# Altium schematic sheet STM32-PROX_4.SchDoc
size 269 x 204 mm
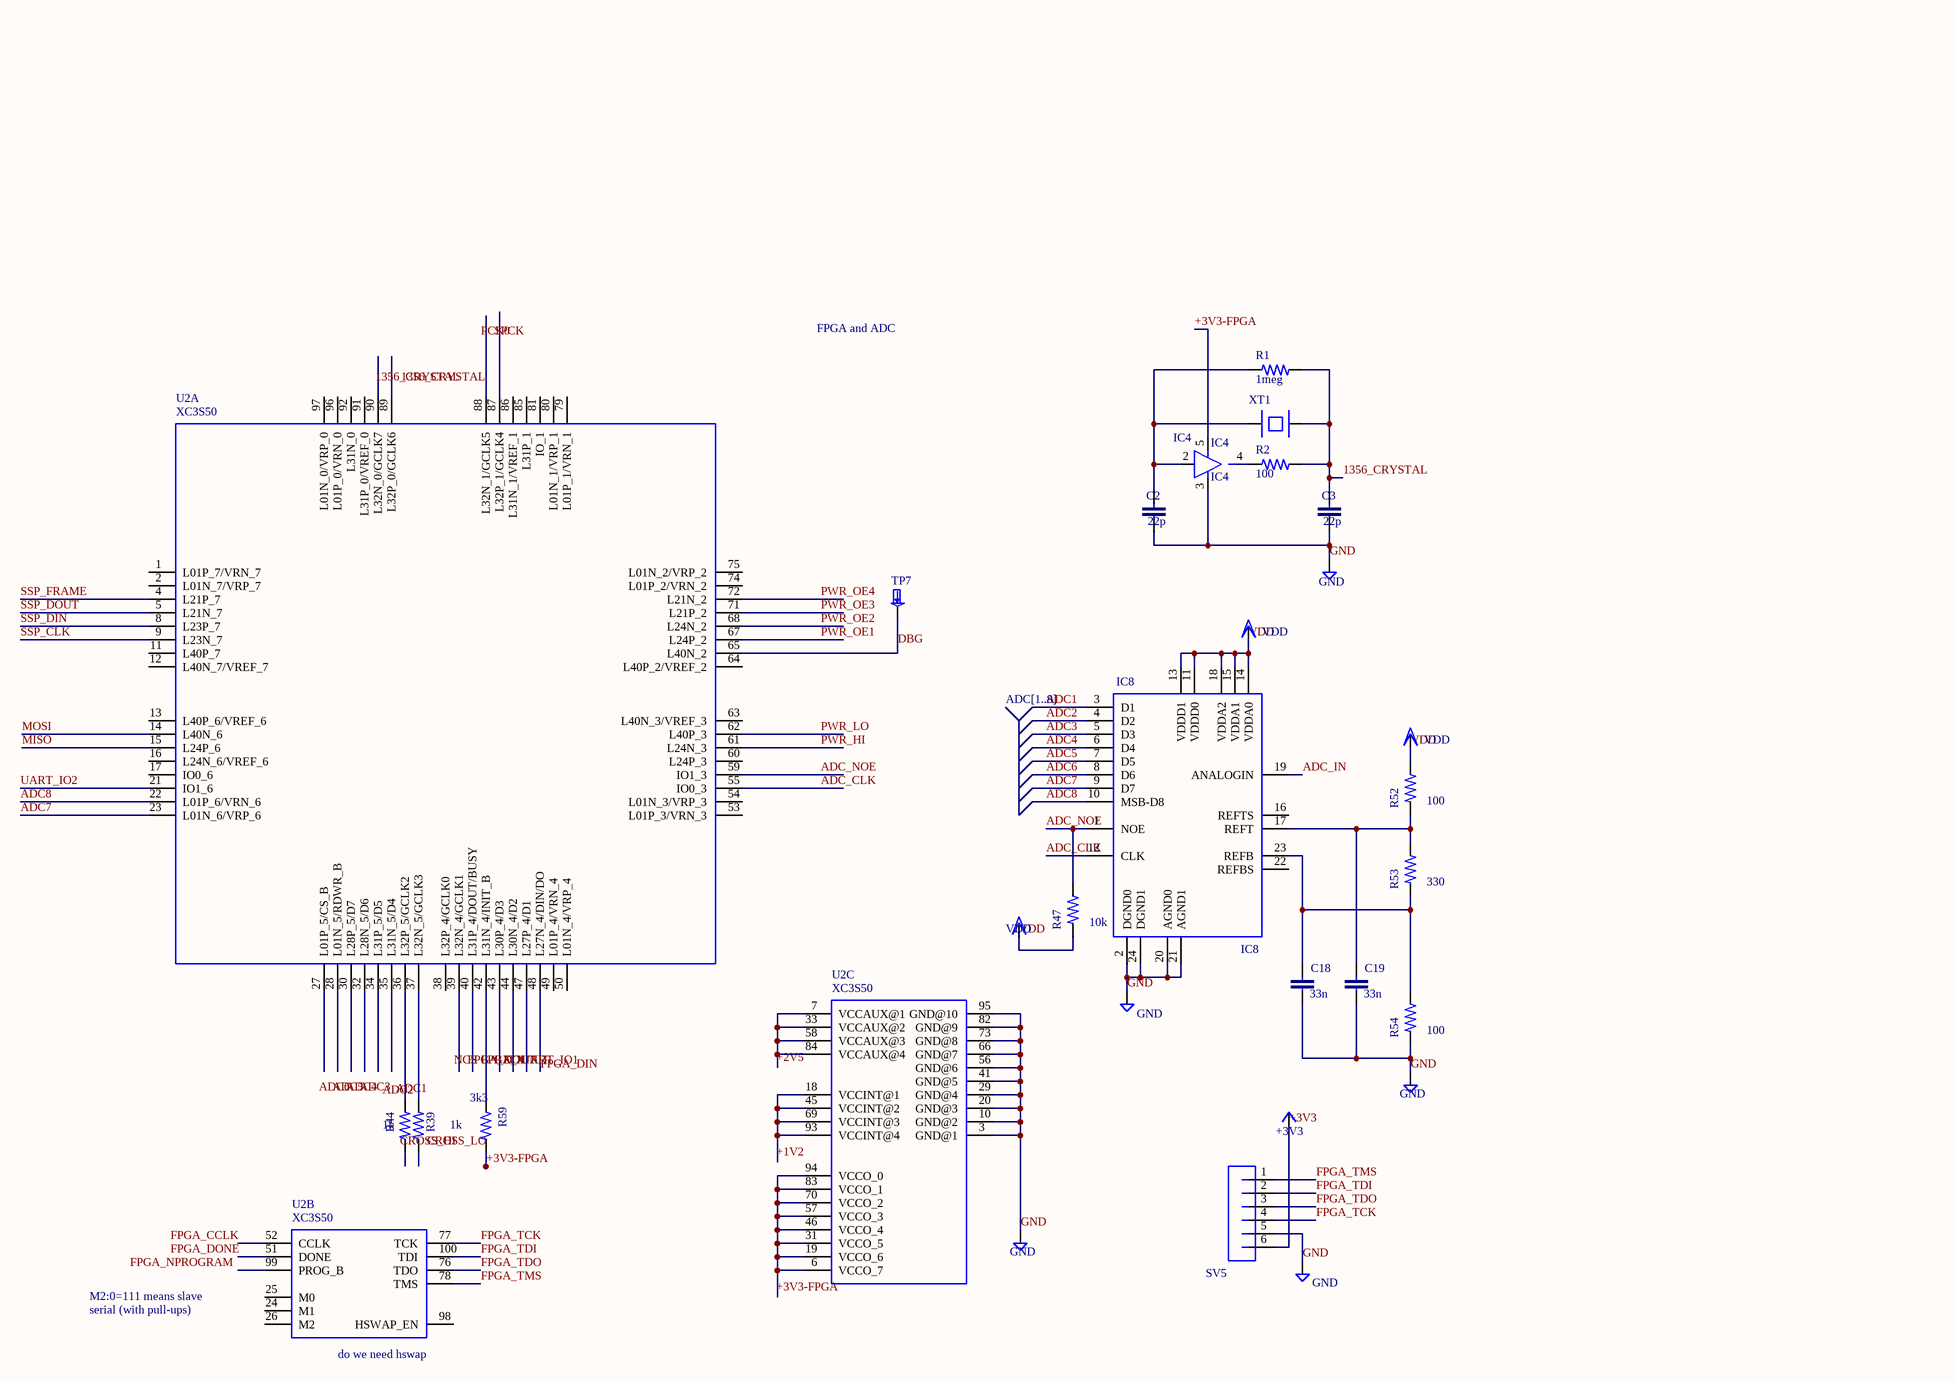
[diagram p0: STM32-PROX_4.SchDoc]

## Parts
C2  22p  [RLC_0603]
C3  22p  [RLC_0603]
C18  33n  [RLC_0603]
C19  33n  [RLC_0603]
IC4  (no value)  [SMV-5]
IC8  (no value)  [TSSOP-24]
R1  1meg  [RLC_0603]
R2  100  [RLC_0603]
R39  1k  [RLC_0603]
R44  1k  [RLC_0603]
R47  10k  [RLC_0603]
R52  100  [RLC_0603]
R53  330  [RLC_0603]
R54  100  [RLC_0603]
R59  3k3  [RLC_0603]
STM32-PROX  GND
SV5  (no value)  [HEADER-MALE-6X1-0.100-UNKEYED]
TP7  (no value)  [KEYSTONE-SMD-TESTPOINT-5015]
U2  XC3S50  [VQ100]  (parts A,B,C of 3)
U$5  +3V3
V7  GND
V24  GND
V28  GND
V55  GND
VDD4  VDD
VDD10  VDD
VDD11  VDD
XT1  (no value)  [XTAL-SMD-CITIZEN-CS10]

## Nets
1356_CRYSTAL: C3.1 R1.2 R2.2 XT1.B
+3V3: SV5.6 U$5.0(+3V3)
+3V3-FPGA: IC4.5(VDD) R59.2
ADC1: IC8.3(D1)
ADC2: IC8.4(D2)
ADC3: IC8.5(D3)
ADC4: IC8.6(D4)
ADC5: IC8.7(D5)
ADC6: IC8.8(D6)
ADC7: IC8.9(D7) U2.23(L01N_6/VRP_6)
ADC8: IC8.10(MSB-D8) U2.22(L01P_6/VRN_6)
ADC_CLK: IC8.12(CLK) U2.55(IO0_3)
ADC_IN: IC8.19(ANALOGIN)
ADC_NOE: IC8.1(NOE) R47.2 U2.59(IO1_3)
DBG: TP7.1(P$1) U2.65(L40N_2)
FPGA_DIN: U2.48(L27N_4/DIN/DO)
FPGA_TCK: SV5.4 U2.77(TCK)
FPGA_TDI: SV5.2 U2.100(TDI)
FPGA_TDO: SV5.3 U2.76(TDO)
FPGA_TMS: SV5.1 U2.78(TMS)
GND: C2.2 C3.2 C18.2 C19.2 IC4.3(VSS) IC8.2(DGND0) IC8.20(AGND0) IC8.21(AGND1) IC8.24(DGND1) R54.1 STM32-PROX.0(GND) SV5.5 U2.3(GND@1) U2.10(GND@2) U2.20(GND@3) U2.29(GND@4) U2.41(GND@5) U2.56(GND@6) U2.66(GND@7) U2.73(GND@8) U2.82(GND@9) U2.95(GND@10) V7.0(GND) V24.0(GND) V28.0(GND) V55.0(GND)
MISO: U2.15(L24P_6)
MOSI: U2.14(L40N_6)
PWR_HI: U2.61(L24N_3)
PWR_LO: U2.62(L40P_3)
PWR_OE1: U2.67(L24P_2)
PWR_OE2: U2.68(L24N_2)
PWR_OE3: U2.71(L21P_2)
PWR_OE4: U2.72(L21N_2)
SSP_CLK: U2.9(L23N_7)
SSP_DIN: U2.8(L23P_7)
SSP_DOUT: U2.5(L21N_7)
SSP_FRAME: U2.4(L21P_7)
UART_IO2: U2.21(IO1_6)
VDD: IC8.11(VDDD0) IC8.13(VDDD1) IC8.14(VDDA0) IC8.15(VDDA1) IC8.18(VDDA2) R47.1 R52.2 VDD4.0(VDD) VDD10.0(VDD) VDD11.0(VDD)
NetC2_1: C2.1 IC4.2(A) R1.1 XT1.A
NetC18_1: C18.1 IC8.23(REFB) R53.1 R54.2
NetC19_1: C19.1 IC8.17(REFT) R52.1 R53.2
NetIC4_4: IC4.4(Y) R2.1
NetR39_2: R39.2 U2.37(L32N_5/GCLK3)
NetR44_2: R44.2 U2.36(L32P_5/GCLK2)
NetR59_1: R59.1 U2.42(L31N_4/INIT_B)
NetU2_6: U2.6(VCCO_7) U2.19(VCCO_6) U2.31(VCCO_5) U2.46(VCCO_4) U2.57(VCCO_3) U2.70(VCCO_2) U2.83(VCCO_1) U2.94(VCCO_0)
NetU2_7: U2.7(VCCAUX@1) U2.33(VCCAUX@2) U2.58(VCCAUX@3) U2.84(VCCAUX@4)
NetU2_18: U2.18(VCCINT@1) U2.45(VCCINT@2) U2.69(VCCINT@3) U2.93(VCCINT@4)

Not connected (* = marked no-connect by the designer): IC8 16(REFTS) 22(REFBS); R39 1; R44 1; U2 1(L01P_7/VRN_7) 2(L01N_7/VRP_7) 11(L40P_7) 12(L40N_7/VREF_7) 13(L40P_6/VREF_6) 16(L24N_6/VREF_6) 17(IO0_6) 24(M1) 25(M0) 26(M2) 27(L01P_5/CS_B) 28(L01N_5/RDWR_B) 30(L28P_5/D7) 32(L28N_5/D6) 34(L31P_5/D5) 35(L31N_5/D4) 38(L32P_4/GCLK0) 39(L32N_4/GCLK1) 40(L31P_4/DOUT/BUSY) 43(L30P_4/D3) 44(L30N_4/D2) 47(L27P_4/D1) 49(L01P_4/VRN_4) 50(L01N_4/VRP_4) 51(DONE) 52(CCLK) 53(L01P_3/VRN_3) 54(L01N_3/VRP_3) 60(L24P_3) 63(L40N_3/VREF_3) 64(L40P_2/VREF_2) 74(L01P_2/VRN_2) 75(L01N_2/VRP_2) 79(L01P_1/VRN_1) 80(L01N_1/VRP_1) 81(IO_1) 85(L31P_1) 86(L31N_1/VREF_1) 87(L32P_1/GCLK4) 88(L32N_1/GCLK5) 89(L32P_0/GCLK6) 90(L32N_0/GCLK7) 91(L31P_0/VREF_0) 92(L31N_0) 96(L01P_0/VRN_0) 97(L01N_0/VRP_0) 98(HSWAP_EN) 99(PROG_B)

## Notes on the sheet
- FPGA and ADC
- (near IC8) ADC[1..8]
- M2:0=111 means slave
- serial (with pull-ups)
- (near U2) do we need hswap
- Labels drawn without touching a wire or pin: 1356_CRYSTAL, +1V2, +2V5, +3V3-FPGA, ADC1, ADC2, ADC3, ADC4, ADC5, ADC6, CROSS_HI, CROSS_LO, FPGA_CCLK, FPGA_DONE, FPGA_DOUT, FPGA_NINIT, FPGA_NPROGRAM, NCS, PCK0, RX, SPCK, TX, UART_IO1

## Library data of the parts
C2 C3 C18 C19 = CAPACITORRLC_0603
IC4 = HCU-INVERTER
IC8 = TLC5540
R1 R2 R39 R44 R47 R52-R54 R59 = RESISTORRLC_0603
SV5 = HEADER-MALE-6X1
TP7 = TESTPADKEYSTONE-SMD
XT1 = XTAL-SMD-CITIZEN-CS10